# EasyEDA schematic SCH_inf3-lab2_2022-05-08.json
TITLE: Schaltplan Labor 2; REV: 1.0; Date: 2022-05-04; Sheet: 1/1; Drawn By: Sören Helms; Company: HAW Hamburg
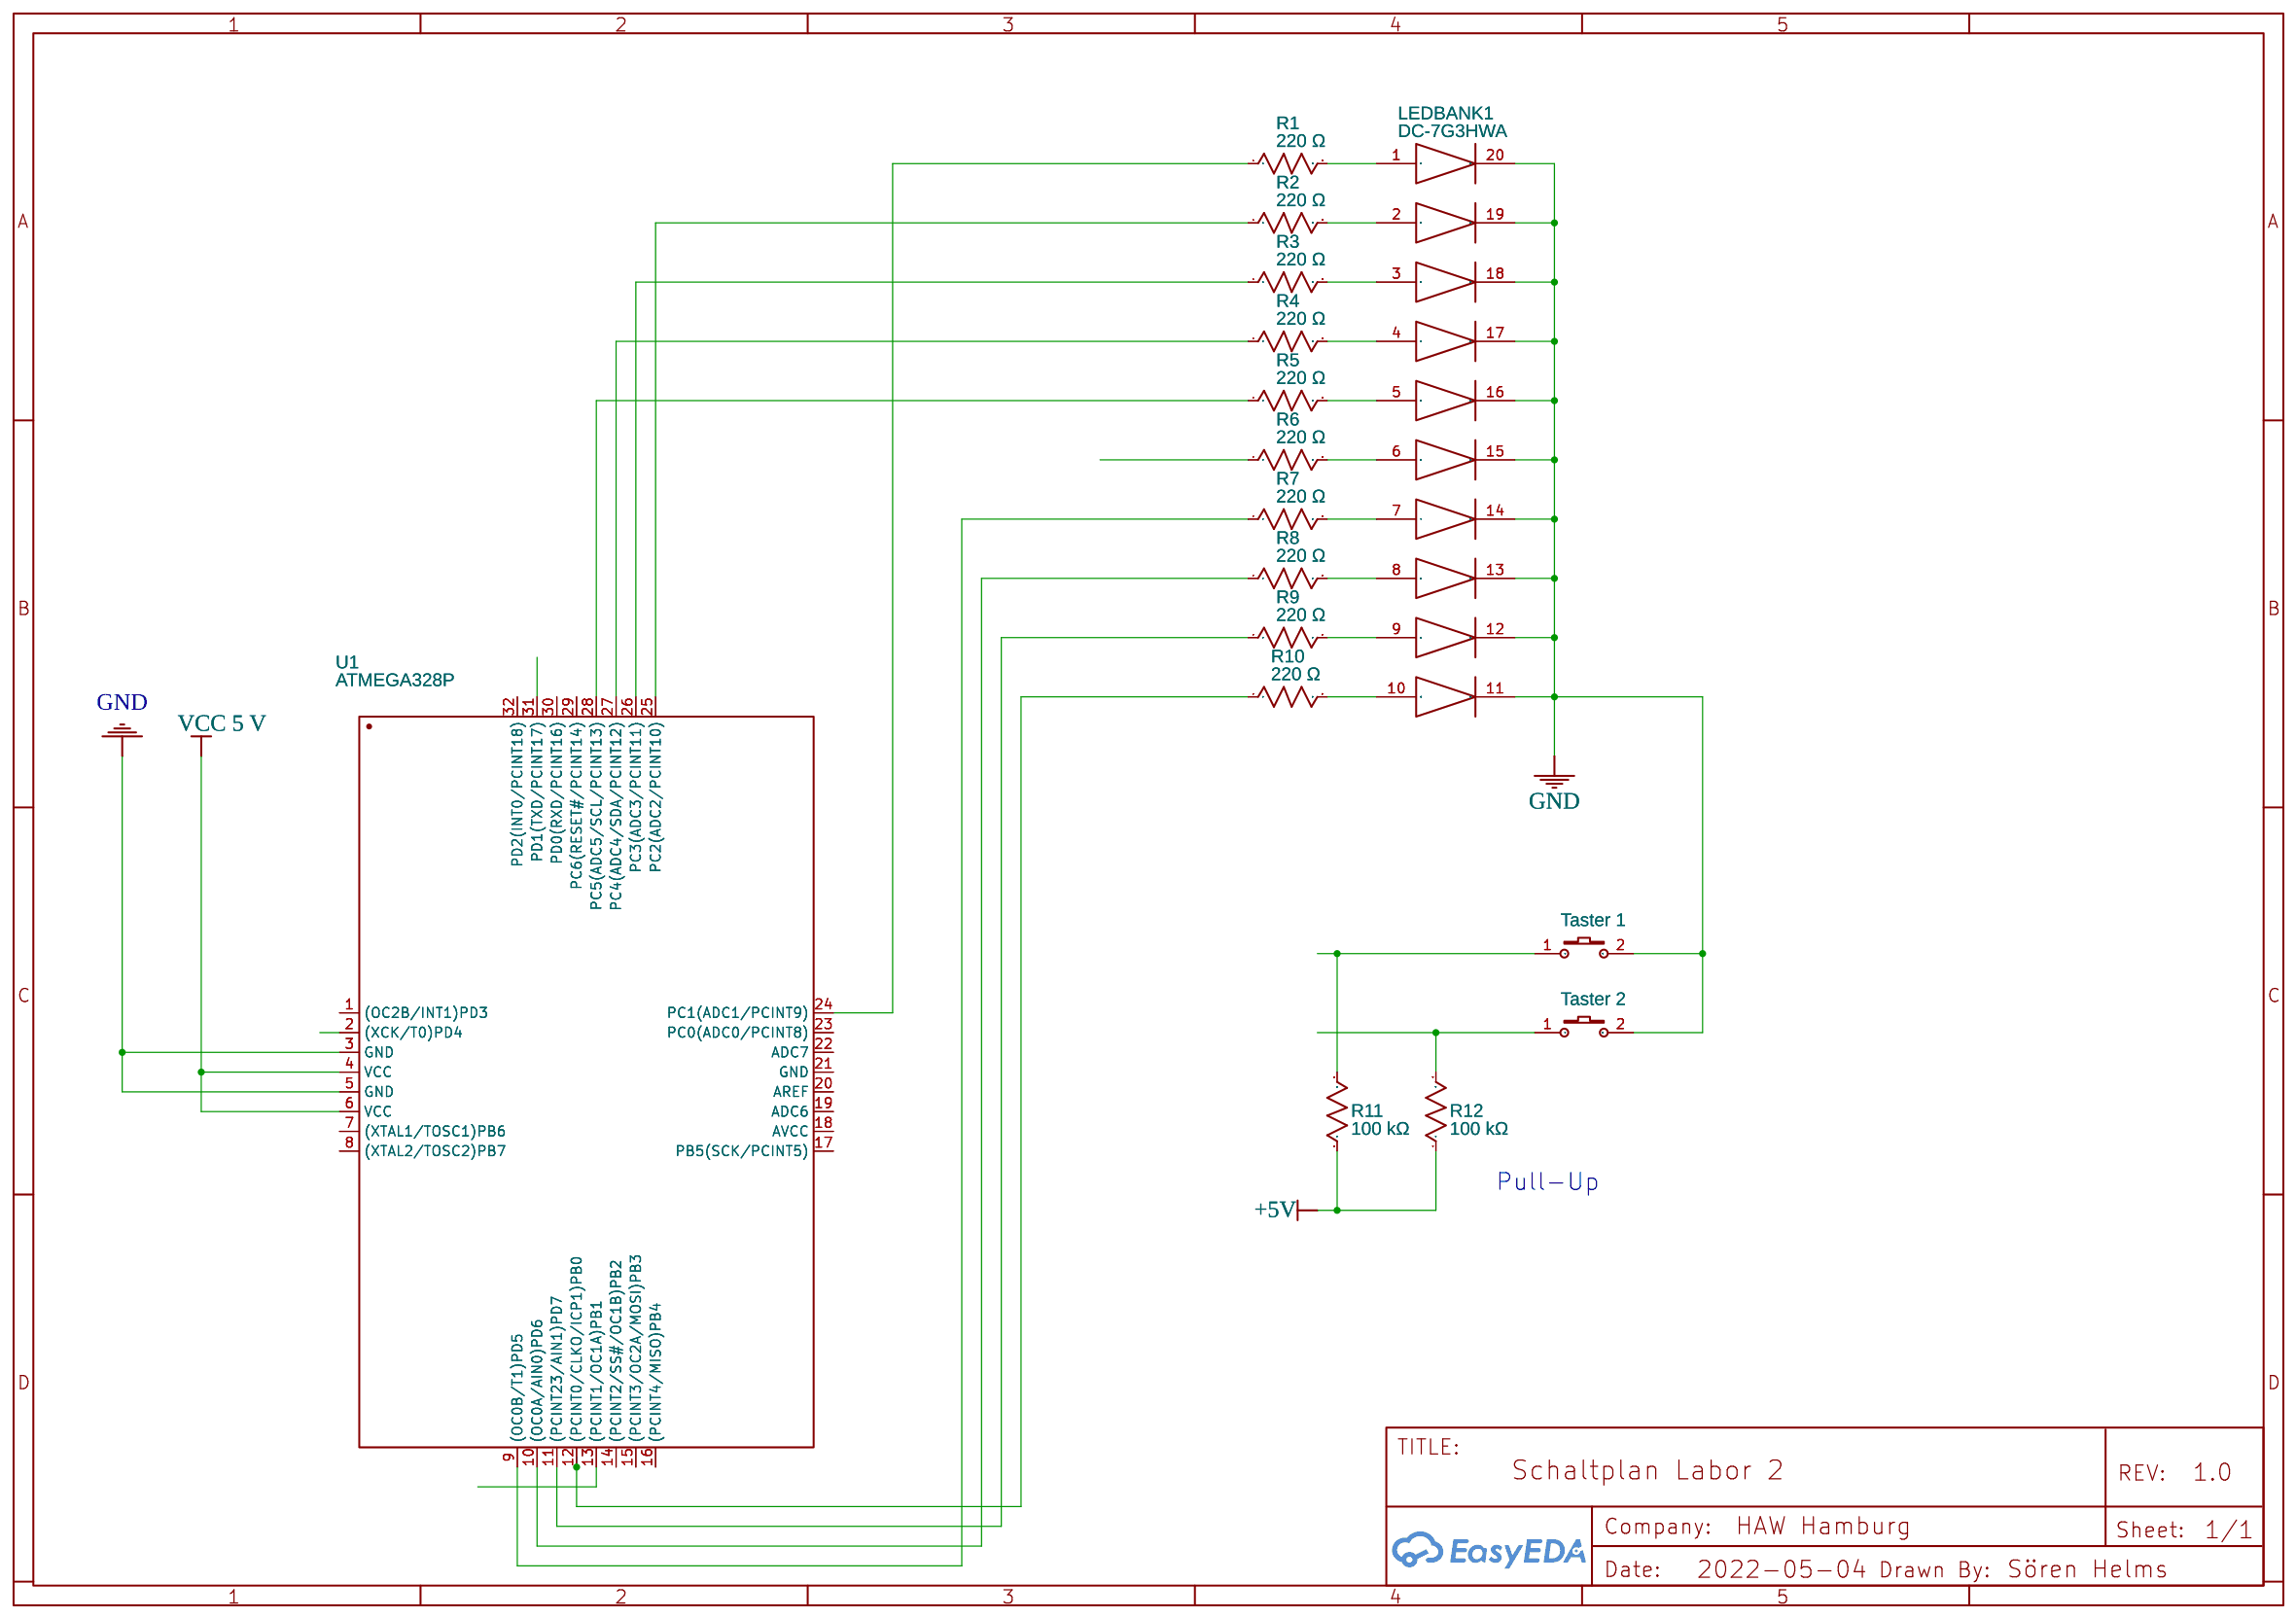
[diagram p0: schematic sheet]

## Parts
KEY1  Taster 1  [KEY-SMD_2P-L6.2-W3.6-LS8.0]
KEY2  Taster 2  [KEY-SMD_2P-L6.2-W3.6-LS8.0]
LEDBANK1  DC-7G3HWA  [DC-7G3HWA]
R1  220 Ω  [R0603]
R2  220 Ω  [R0603]
R3  220 Ω  [R0603]
R4  220 Ω  [R0603]
R5  220 Ω  [R0603]
R6  220 Ω  [R0603]
R7  220 Ω  [R0603]
R8  220 Ω  [R0603]
R9  220 Ω  [R0603]
R10  220 Ω  [R0603]
R11  100 kΩ  [R0603]
R12  100 kΩ  [R0603]
U1  ATMEGA328P  [LQFP-32_L7.0-W7.0-P0.80-LS9.0-TL]

## Library data of the parts
KEY1 KEY2 = K2-3.6×6.1_SMD: Supplier Part: C118141; Supplier: LCSC; Manufacturer Part: K2-1107ST-A4SW-06; Contributor: LCEDA_Lib; 制造商: 韩国韩荣
LEDBANK1 = DC-7G3HWA: Supplier Part: undefined; Contributor: Wolfdred
R1-R12 = R_0603_US: Contributor: LCEDA_Lib
U1 = ATMEGA328P: Supplier: LCSC; Supplier Part: C9900009806; Manufacturer: null; Manufacturer Part: ATmega328P; Contributor: LCSC; JLCPCB Part Class: Extended Part

## Nets
+5V: R11.1 R12.1
GND: KEY1.2 KEY2.2 LEDBANK1.11 LEDBANK1.12 LEDBANK1.13 LEDBANK1.14 LEDBANK1.15 LEDBANK1.16 LEDBANK1.17 LEDBANK1.18 LEDBANK1.19 LEDBANK1.20 U1.3(GND) U1.5(GND)
VCC 5 V: U1.4(VCC) U1.6(VCC)
Net-(KEY1-1): KEY1.1 R11.2
Net-(KEY2-1): KEY2.1 R12.2
Net-(LEDBANK1-1): LEDBANK1.1 R1.2
Net-(LEDBANK1-2): LEDBANK1.2 R2.2
Net-(LEDBANK1-3): LEDBANK1.3 R3.2
Net-(LEDBANK1-4): LEDBANK1.4 R4.2
Net-(LEDBANK1-5): LEDBANK1.5(21) R5.2
Net-(LEDBANK1-6): LEDBANK1.6 R6.2
Net-(LEDBANK1-7): LEDBANK1.7 R7.2
Net-(LEDBANK1-8): LEDBANK1.8 R8.2
Net-(LEDBANK1-9): LEDBANK1.9 R9.2
Net-(LEDBANK1-10): LEDBANK1.10 R10.2
Net-(R1-1): R1.1 U1.24(PC1(ADC1/PCINT9))
Net-(R2-1): R2.1 U1.25(PC2(ADC2/PCINT10))
Net-(R3-1): R3.1 U1.26(PC3(ADC3/PCINT11))
Net-(R4-1): R4.1 U1.27(PC4(ADC4/SDA/PCINT12))
Net-(R5-1): R5.1 U1.28(PC5(ADC5/SCL/PCINT13))
Net-(R7-1): R7.1 U1.9((OC0B/T1)PD5)
Net-(R8-1): R8.1 U1.10((OC0A/AIN0)PD6)
Net-(R9-1): R9.1 U1.11((PCINT23/AIN1)PD7)
Net-(R10-1): R10.1 U1.12((PCINT0/CLKO/ICP1)PB0)

Not connected (* = marked no-connect by the designer): R6 1; U1 1((OC2B/INT1)PD3) 2((XCK/T0)PD4) 7((XTAL1/TOSC1)PB6) 8((XTAL2/TOSC2)PB7) 13((PCINT1/OC1A)PB1) 14((PCINT2/SS#/OC1B)PB2) 15((PCINT3/OC2A/MOSI)PB3) 16((PCINT4/MISO)PB4) 17(PB5(SCK/PCINT5)) 18(AVCC) 19(ADC6) 20(AREF) 21(GND) 22(ADC7) 23(PC0(ADC0/PCINT8)) 29(PC6(RESET#/PCINT14)) 30(PD0(RXD/PCINT16)) 31(PD1(TXD/PCINT17)) 32(PD2(INT0/PCINT18))

## Notes on the sheet
- Pull-Up
